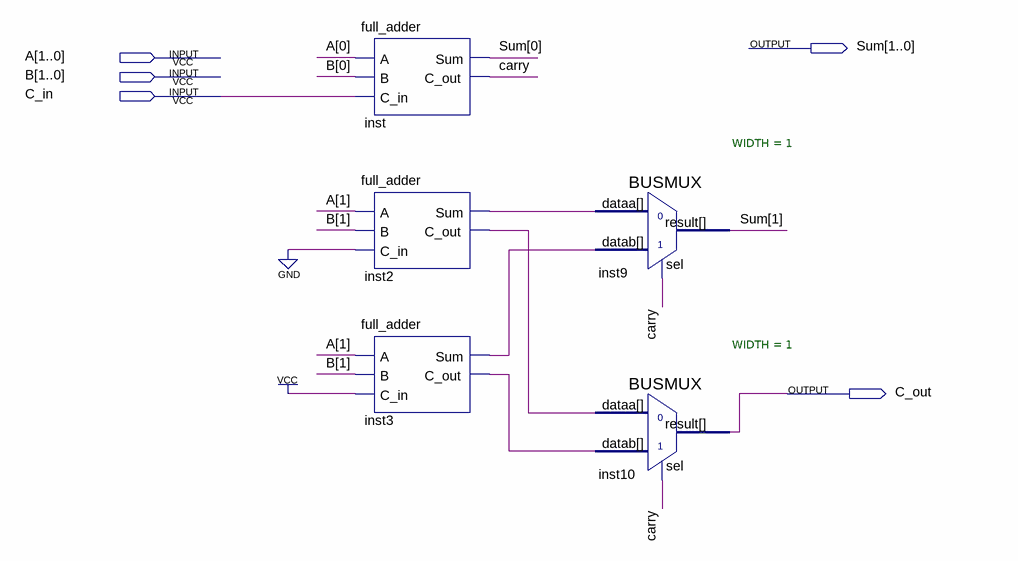
[diagram p0: schematic sheet]
// Quartus schematic full_adder_b2.bdf as structural Verilog: 5 symbols, 5 pins
module full_adder_b2 (
  input  [1:0] A,
  input  [1:0] B,
  input  C_in,
  output [1:0] Sum,
  output C_out
);

  wire carry, inst2_c_out, inst2_sum, inst3_c_out, inst3_sum;

  full_adder inst (.A(A[0]), .B(B[0]), .C_in(C_in), .Sum(Sum[0]), .C_out(carry));
  full_adder inst2 (.A(A[1]), .B(B[1]), .C_in(1'b0), .Sum(inst2_sum), .C_out(inst2_c_out));
  full_adder inst3 (.A(A[1]), .B(B[1]), .C_in(1'b1), .Sum(inst3_sum), .C_out(inst3_c_out));
  BUSMUX #(.WIDTH(1)) inst9 (.datab(inst3_sum), .sel(carry), .dataa(inst2_sum), .result(Sum[1]));
  BUSMUX #(.WIDTH(1)) inst10 (.datab(inst3_c_out), .sel(carry), .dataa(inst2_c_out), .result(C_out));
endmodule
